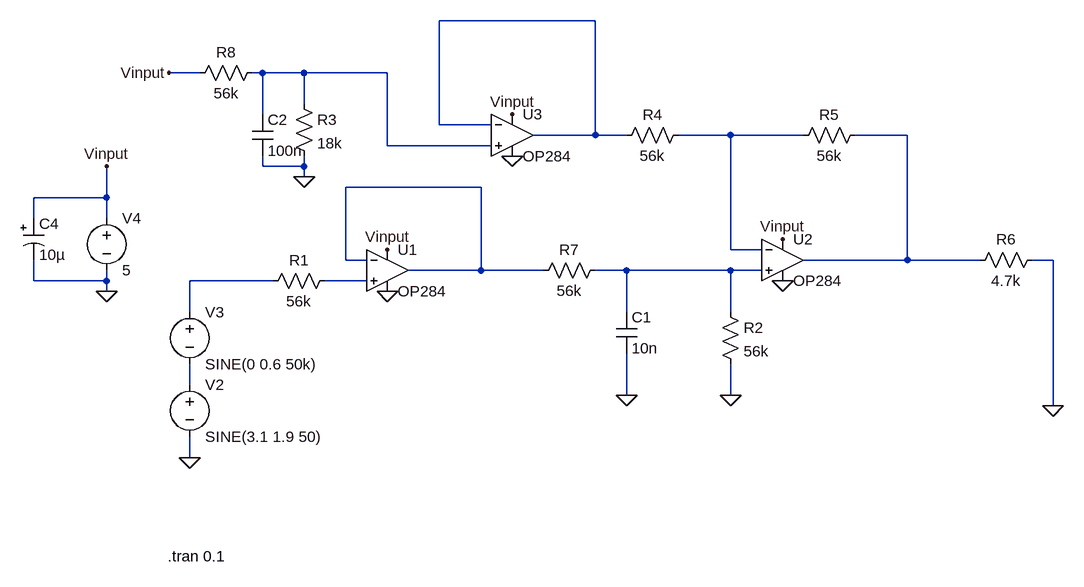
[diagram p0: schematic wind_direction_schematic.asc]
wind_direction_schematic.asc, the LTspice schematic file:
Version 4
SHEET 1 1892 680
WIRE 688 -512 448 -512
WIRE 80 -432 32 -432
WIRE 176 -432 160 -432
WIRE 240 -432 176 -432
WIRE 368 -432 240 -432
WIRE 240 -384 240 -432
WIRE 176 -368 176 -432
WIRE 448 -352 448 -512
WIRE 528 -352 448 -352
WIRE 688 -336 688 -512
WIRE 688 -336 592 -336
WIRE 736 -336 688 -336
WIRE 896 -336 816 -336
WIRE 1008 -336 896 -336
WIRE 1168 -336 1088 -336
WIRE 368 -320 368 -432
WIRE 528 -320 368 -320
WIRE 176 -288 176 -304
WIRE 240 -288 240 -304
WIRE 240 -288 176 -288
WIRE 240 -272 240 -288
WIRE 512 -256 304 -256
WIRE -64 -240 -64 -288
WIRE -64 -240 -176 -240
WIRE -176 -208 -176 -240
WIRE -64 -208 -64 -240
WIRE 896 -160 896 -336
WIRE 944 -160 896 -160
WIRE 304 -144 304 -256
WIRE 336 -144 304 -144
WIRE 1168 -144 1168 -336
WIRE 1168 -144 1008 -144
WIRE 1280 -144 1168 -144
WIRE 1392 -144 1360 -144
WIRE 512 -128 512 -256
WIRE 512 -128 400 -128
WIRE 608 -128 512 -128
WIRE 736 -128 688 -128
WIRE 896 -128 736 -128
WIRE 944 -128 896 -128
WIRE -176 -112 -176 -144
WIRE -64 -112 -64 -128
WIRE -64 -112 -176 -112
WIRE 192 -112 64 -112
WIRE 336 -112 272 -112
WIRE -64 -96 -64 -112
WIRE 64 -64 64 -112
WIRE 736 -64 736 -128
WIRE 896 -64 896 -128
WIRE 64 48 64 16
WIRE 736 64 736 0
WIRE 896 64 896 16
WIRE 1392 80 1392 -144
WIRE 64 160 64 128
FLAG 368 -160 Vinput
FLAG 368 -96 0
FLAG 976 -112 0
FLAG 896 64 0
FLAG 976 -176 Vinput
FLAG 1392 80 0
FLAG 64 160 0
FLAG 736 64 0
FLAG 560 -304 0
FLAG 560 -368 Vinput
FLAG 240 -272 0
FLAG 32 -432 Vinput
FLAG -64 -96 0
FLAG -64 -288 Vinput
SYMBOL voltage 64 32 R0
WINDOW 123 0 0 Left 0
WINDOW 39 0 0 Left 0
SYMATTR InstName V2
SYMATTR Value SINE(3.1 1.9 50)
SYMBOL voltage 64 -80 R0
WINDOW 123 0 0 Left 0
WINDOW 39 0 0 Left 0
SYMATTR InstName V3
SYMATTR Value SINE(0 0.6 50k)
SYMBOL res 288 -128 R90
WINDOW 0 0 56 VBottom 2
WINDOW 3 32 56 VTop 2
SYMATTR InstName R1
SYMATTR Value 56k
SYMBOL OpAmps\\OP284 368 -192 R0
SYMATTR InstName U1
SYMBOL voltage -64 -224 R0
WINDOW 123 0 0 Left 0
WINDOW 39 0 0 Left 0
SYMATTR InstName V4
SYMATTR Value 5
SYMBOL OpAmps\\OP284 976 -208 R0
SYMATTR InstName U2
SYMBOL res 880 -80 R0
SYMATTR InstName R2
SYMATTR Value 56k
SYMBOL res 832 -352 R90
WINDOW 0 0 56 VBottom 2
WINDOW 3 32 56 VTop 2
SYMATTR InstName R4
SYMATTR Value 56k
SYMBOL res 1104 -352 R90
WINDOW 0 0 56 VBottom 2
WINDOW 3 32 56 VTop 2
SYMATTR InstName R5
SYMATTR Value 56k
SYMBOL res 1376 -160 R90
WINDOW 0 0 56 VBottom 2
WINDOW 3 32 56 VTop 2
SYMATTR InstName R6
SYMATTR Value 4.7k
SYMBOL res 704 -144 R90
WINDOW 0 0 56 VBottom 2
WINDOW 3 32 56 VTop 2
SYMATTR InstName R7
SYMATTR Value 56k
SYMBOL cap 720 -64 R0
SYMATTR InstName C1
SYMATTR Value 10n
SYMBOL OpAmps\\OP284 560 -400 R0
SYMATTR InstName U3
SYMBOL res 224 -400 R0
SYMATTR InstName R3
SYMATTR Value 18k
SYMBOL res 176 -448 R90
WINDOW 0 0 56 VBottom 2
WINDOW 3 32 56 VTop 2
SYMATTR InstName R8
SYMATTR Value 56k
SYMBOL cap 160 -368 R0
SYMATTR InstName C2
SYMATTR Value 100n
SYMBOL polcap -192 -208 R0
SYMATTR InstName C4
SYMATTR Value 10µ
TEXT 30 312 Left 2 !.tran 0.1

The netlist it stands for:
* wind_direction_schematic.asc
V2 N009 0 SINE(3.1 1.9 50)
V3 N007 N009 SINE(0 0.6 50k)
R1 N008 N007 56k
XU1 N008 N005 Vinput 0 N005 OP284  ; pins In+ In- V+ V- OUT
V4 Vinput 0 5
XU2 N006 N003 Vinput 0 N004 OP284  ; pins In+ In- V+ V- OUT
R2 N006 0 56k
R4 N003 N001 56k
R5 N004 N003 56k
R6 0 N004 4.7k
R7 N006 N005 56k
C1 N006 0 10n
XU3 N002 N001 Vinput 0 N001 OP284  ; pins In+ In- V+ V- OUT
R3 N002 0 18k
R8 N002 Vinput 56k
C2 N002 0 100n
C4 Vinput 0 10µ
.tran 0.1
.lib ADI1.lib
.backanno
.end